# EAGLE schematic at32 (EAGLE 6.1)
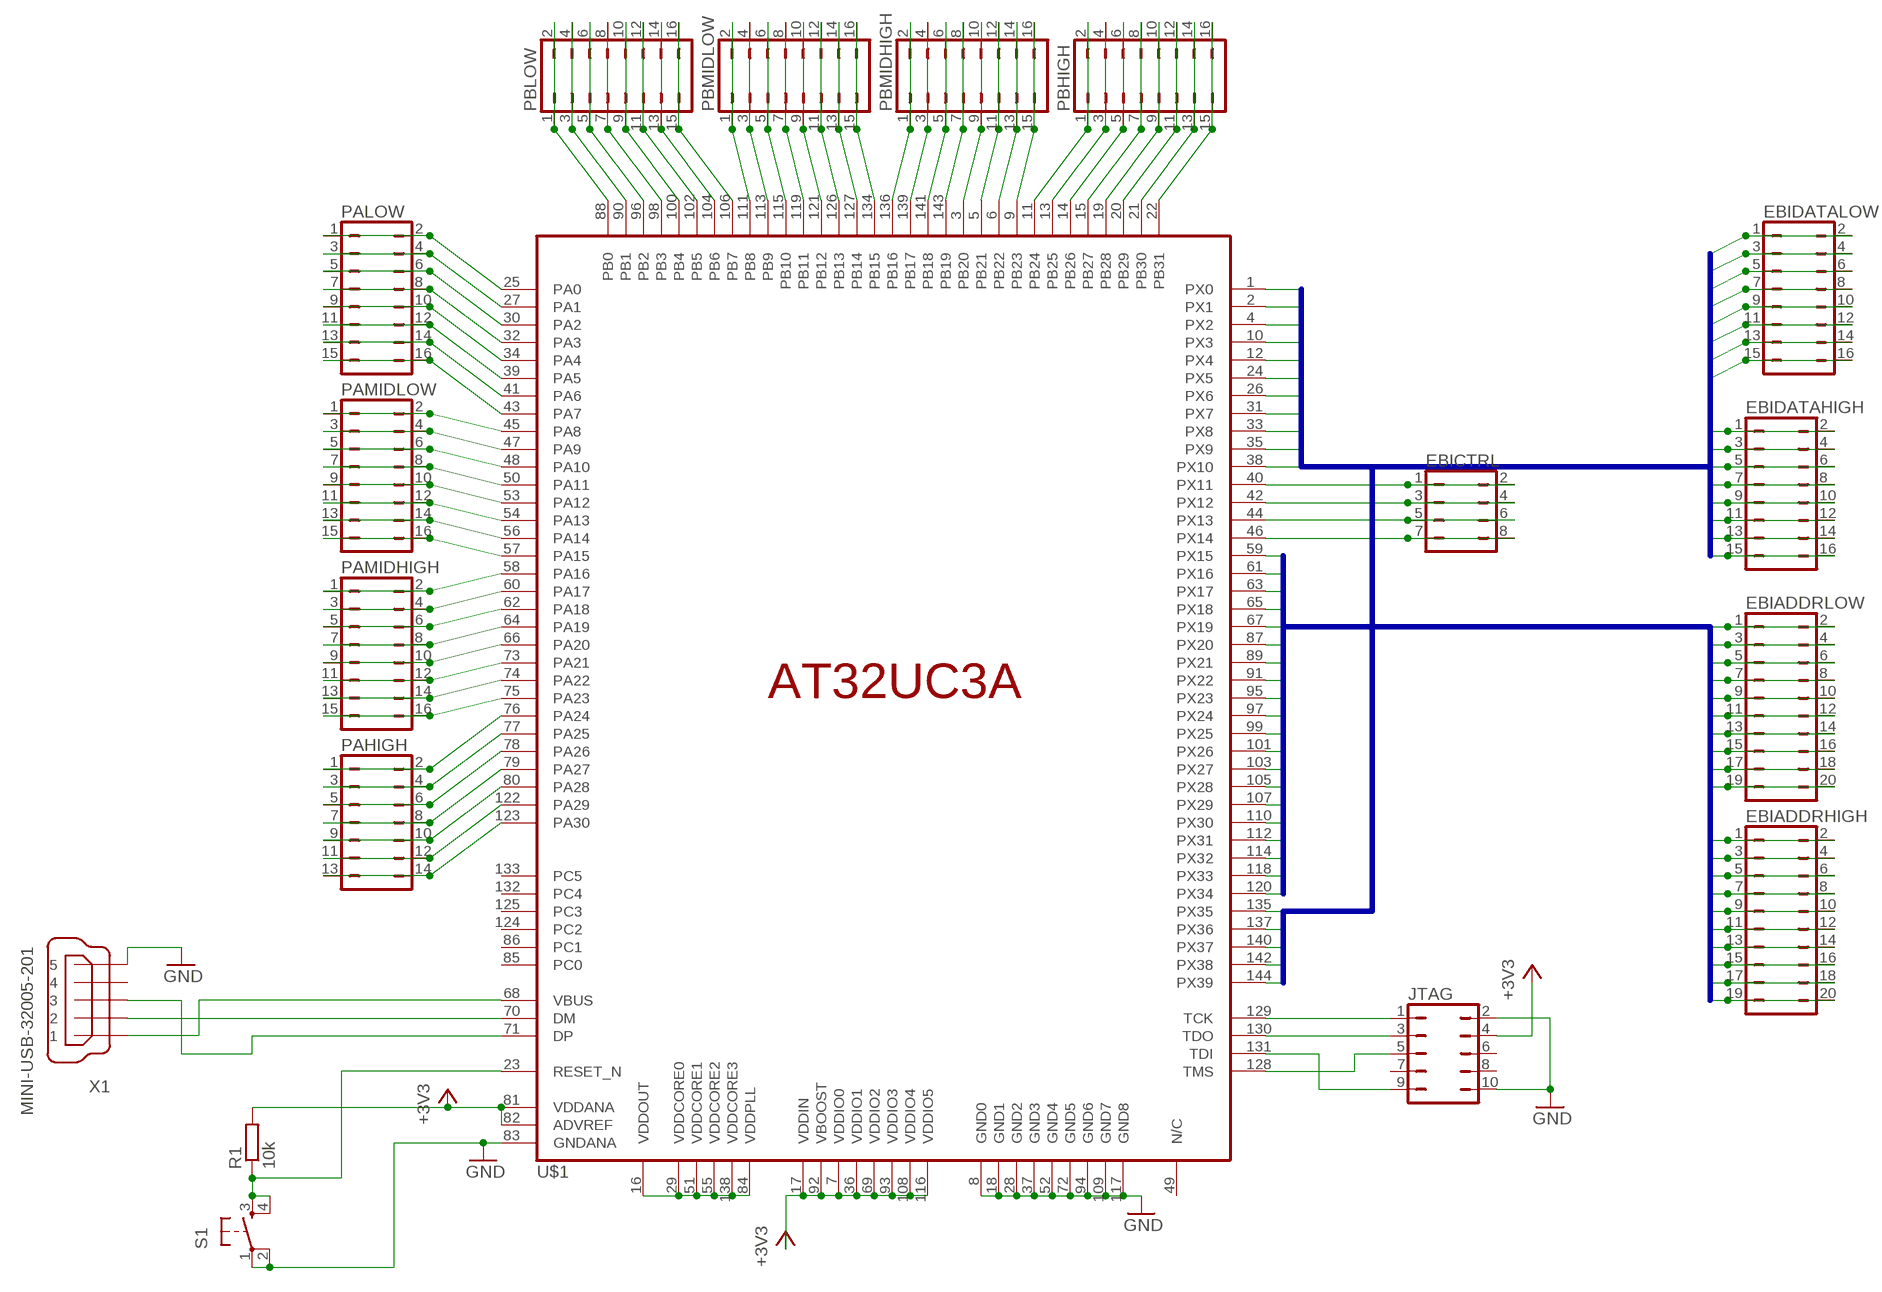
[diagram p0: schematic, sheet 1]

## Parts
EBIADDRHIGH  JP10Q  [JP10Q]
EBIADDRLOW  JP10Q  [JP10Q]
EBICTRL  JP4Q  [JP4Q]
EBIDATAHIGH  JP8Q  [JP8Q]
EBIDATALOW  JP8Q  [JP8Q]
JTAG  JP5Q  [JP5Q]
PAHIGH  JP7Q  [JP7Q]
PALOW  JP8Q  [JP8Q]
PAMIDHIGH  JP8Q  [JP8Q]
PAMIDLOW  JP8Q  [JP8Q]
PBHIGH  JP8Q  [JP8Q]
PBLOW  JP8Q  [JP8Q]
PBMIDHIGH  JP8Q  [JP8Q]
PBMIDLOW  JP8Q  [JP8Q]
R1  10k  R-EU_M2012  [M2012]
S1  TAC_SWITCHPTH  [TACTILE-PTH]
U$1  AVR32UC3AVQFP144  [VQFP144]
X1  MINI-USB-32005-201  [32005-201]

## Nets
+3V3: JTAG.4 R1.2 U$1.7(VDDIO0) U$1.17(VDDIN) U$1.36(VDDIO1) U$1.69(VDDIO2) U$1.81(VDDANA) U$1.82(ADVREF) U$1.92(VBOOST) U$1.93(VDDIO3) U$1.108(VDDIO4) U$1.116(VDDIO5)
EBIADDR0: EBIADDRLOW.1 EBIADDRLOW.2 U$1.120(PX34)
EBIADDR1: EBIADDRLOW.3 EBIADDRLOW.4 U$1.118(PX33)
EBIADDR2: EBIADDRLOW.5 EBIADDRLOW.6 U$1.114(PX32)
EBIADDR3: EBIADDRLOW.7 EBIADDRLOW.8 U$1.112(PX31)
EBIADDR4: EBIADDRLOW.9 EBIADDRLOW.10 U$1.110(PX30)
EBIADDR5: EBIADDRLOW.11 EBIADDRLOW.12 U$1.107(PX29)
EBIADDR6: EBIADDRLOW.13 EBIADDRLOW.14 U$1.105(PX28)
EBIADDR7: EBIADDRLOW.15 EBIADDRLOW.16 U$1.103(PX27)
EBIADDR8: EBIADDRLOW.17 EBIADDRLOW.18 U$1.101(PX26)
EBIADDR9: EBIADDRLOW.19 EBIADDRLOW.20 U$1.99(PX25)
EBIADDR10: EBIADDRHIGH.1 EBIADDRHIGH.2 U$1.97(PX24)
EBIADDR11: EBIADDRHIGH.3 EBIADDRHIGH.4 U$1.95(PX23)
EBIADDR12: EBIADDRHIGH.5 EBIADDRHIGH.6 U$1.91(PX22)
EBIADDR13: EBIADDRHIGH.7 EBIADDRHIGH.8 U$1.89(PX21)
EBIADDR14: EBIADDRHIGH.9 EBIADDRHIGH.10 U$1.87(PX20)
EBIADDR15: EBIADDRHIGH.11 EBIADDRHIGH.12 U$1.67(PX19)
EBIADDR16: EBIADDRHIGH.13 EBIADDRHIGH.14 U$1.65(PX18)
EBIADDR17: EBIADDRHIGH.15 EBIADDRHIGH.16 U$1.63(PX17)
EBIADDR18: EBIADDRHIGH.17 EBIADDRHIGH.18 U$1.61(PX16)
EBIADDR19: EBIADDRHIGH.19 EBIADDRHIGH.20 U$1.59(PX15)
EBIDATA0: EBIDATALOW.1 EBIDATALOW.2 U$1.38(PX10)
EBIDATA1: EBIDATALOW.3 EBIDATALOW.4 U$1.35(PX9)
EBIDATA2: EBIDATALOW.5 EBIDATALOW.6 U$1.33(PX8)
EBIDATA3: EBIDATALOW.7 EBIDATALOW.8 U$1.31(PX7)
EBIDATA4: EBIDATALOW.9 EBIDATALOW.10 U$1.26(PX6)
EBIDATA5: EBIDATALOW.11 EBIDATALOW.12 U$1.24(PX5)
EBIDATA6: EBIDATALOW.13 EBIDATALOW.14 U$1.12(PX4)
EBIDATA7: EBIDATALOW.15 EBIDATALOW.16 U$1.10(PX3)
EBIDATA8: EBIDATAHIGH.1 EBIDATAHIGH.2 U$1.4(PX2)
EBIDATA9: EBIDATAHIGH.3 EBIDATAHIGH.4 U$1.2(PX1)
EBIDATA10: EBIDATAHIGH.5 EBIDATAHIGH.6 U$1.1(PX0)
EBIDATA11: EBIDATAHIGH.7 EBIDATAHIGH.8 U$1.144(PX39)
EBIDATA12: EBIDATAHIGH.9 EBIDATAHIGH.10 U$1.142(PX38)
EBIDATA13: EBIDATAHIGH.11 EBIDATAHIGH.12 U$1.140(PX37)
EBIDATA14: EBIDATAHIGH.13 EBIDATAHIGH.14 U$1.137(PX36)
EBIDATA15: EBIDATAHIGH.15 EBIDATAHIGH.16 U$1.135(PX35)
GND: JTAG.2 JTAG.10 S1.1 S1.2 U$1.8(GND0) U$1.18(GND1) U$1.28(GND2) U$1.37(GND3) U$1.52(GND4) U$1.72(GND5) U$1.83(GNDANA) U$1.94(GND6) U$1.109(GND7) U$1.117(GND8) X1.5
N$1: U$1.70(DM) X1.2
N$2: U$1.68(VBUS) X1.1
N$3: U$1.71(DP) X1.3
N$4: EBICTRL.1 EBICTRL.2 U$1.40(PX11)
N$5: JTAG.1 U$1.129(TCK)
N$6: JTAG.3 U$1.130(TDO)
N$7: JTAG.5 U$1.128(TMS)
N$8: JTAG.9 U$1.131(TDI)
N$9: U$1.16(VDDOUT) U$1.29(VDDCORE0) U$1.51(VDDCORE1) U$1.55(VDDCORE2) U$1.84(VDDPLL) U$1.138(VDDCORE3)
N$10: EBICTRL.3 EBICTRL.4 U$1.42(PX12)
N$11: EBICTRL.5 EBICTRL.6 U$1.44(PX13)
N$12: EBICTRL.7 EBICTRL.8 U$1.46(PX14)
N$13: PBLOW.1 PBLOW.2 U$1.88(PB0)
N$14: PBLOW.3 PBLOW.4 U$1.90(PB1)
N$15: PBLOW.5 PBLOW.6 U$1.96(PB2)
N$16: PBLOW.7 PBLOW.8 U$1.98(PB3)
N$17: PBLOW.9 PBLOW.10 U$1.100(PB4)
N$18: PBLOW.11 PBLOW.12 U$1.102(PB5)
N$19: PBLOW.13 PBLOW.14 U$1.104(PB6)
N$20: PBLOW.15 PBLOW.16 U$1.106(PB7)
N$21: PBMIDLOW.1 PBMIDLOW.2 U$1.111(PB8)
N$22: PBMIDLOW.3 PBMIDLOW.4 U$1.113(PB9)
N$23: PBMIDLOW.5 PBMIDLOW.6 U$1.115(PB10)
N$24: PBMIDLOW.7 PBMIDLOW.8 U$1.119(PB11)
N$25: PBMIDLOW.9 PBMIDLOW.10 U$1.121(PB12)
N$26: PBMIDLOW.11 PBMIDLOW.12 U$1.126(PB13)
N$27: PBMIDLOW.13 PBMIDLOW.14 U$1.127(PB14)
N$28: PBMIDLOW.15 PBMIDLOW.16 U$1.134(PB15)
N$29: PBMIDHIGH.1 PBMIDHIGH.2 U$1.136(PB16)
N$30: PBMIDHIGH.3 PBMIDHIGH.4 U$1.139(PB17)
N$31: PBMIDHIGH.5 PBMIDHIGH.6 U$1.141(PB18)
N$32: PBMIDHIGH.7 PBMIDHIGH.8 U$1.143(PB19)
N$33: PBMIDHIGH.9 PBMIDHIGH.10 U$1.3(PB20)
N$34: PBMIDHIGH.11 PBMIDHIGH.12 U$1.5(PB21)
N$35: PBMIDHIGH.13 PBMIDHIGH.14 U$1.6(PB22)
N$36: PBMIDHIGH.15 PBMIDHIGH.16 U$1.9(PB23)
N$37: PBHIGH.1 PBHIGH.2 U$1.11(PB24)
N$38: PBHIGH.3 PBHIGH.4 U$1.13(PB25)
N$39: PBHIGH.5 PBHIGH.6 U$1.14(PB26)
N$40: PBHIGH.7 PBHIGH.8 U$1.15(PB27)
N$41: PBHIGH.9 PBHIGH.10 U$1.19(PB28)
N$42: PBHIGH.11 PBHIGH.12 U$1.20(PB29)
N$43: PBHIGH.13 PBHIGH.14 U$1.21(PB30)
N$44: PBHIGH.15 PBHIGH.16 U$1.22(PB31)
N$45: PAHIGH.13 PAHIGH.14 U$1.123(PA30)
N$46: PAHIGH.11 PAHIGH.12 U$1.122(PA29)
N$47: PAHIGH.9 PAHIGH.10 U$1.80(PA28)
N$48: PAHIGH.7 PAHIGH.8 U$1.79(PA27)
N$49: PAHIGH.5 PAHIGH.6 U$1.78(PA26)
N$50: PAHIGH.3 PAHIGH.4 U$1.77(PA25)
N$51: PAHIGH.1 PAHIGH.2 U$1.76(PA24)
N$52: PAMIDHIGH.15 PAMIDHIGH.16 U$1.75(PA23)
N$53: PAMIDHIGH.13 PAMIDHIGH.14 U$1.74(PA22)
N$54: PAMIDHIGH.11 PAMIDHIGH.12 U$1.73(PA21)
N$55: PAMIDHIGH.9 PAMIDHIGH.10 U$1.66(PA20)
N$56: PAMIDHIGH.7 PAMIDHIGH.8 U$1.64(PA19)
N$57: PAMIDHIGH.5 PAMIDHIGH.6 U$1.62(PA18)
N$58: PAMIDHIGH.3 PAMIDHIGH.4 U$1.60(PA17)
N$59: PAMIDHIGH.1 PAMIDHIGH.2 U$1.58(PA16)
N$60: PAMIDLOW.15 PAMIDLOW.16 U$1.57(PA15)
N$61: PAMIDLOW.13 PAMIDLOW.14 U$1.56(PA14)
N$62: PAMIDLOW.11 PAMIDLOW.12 U$1.54(PA13)
N$63: PAMIDLOW.9 PAMIDLOW.10 U$1.53(PA12)
N$64: PAMIDLOW.7 PAMIDLOW.8 U$1.50(PA11)
N$65: PAMIDLOW.5 PAMIDLOW.6 U$1.48(PA10)
N$66: PAMIDLOW.3 PAMIDLOW.4 U$1.47(PA9)
N$67: PAMIDLOW.1 PAMIDLOW.2 U$1.45(PA8)
N$68: PALOW.15 PALOW.16 U$1.43(PA7)
N$69: PALOW.13 PALOW.14 U$1.41(PA6)
N$70: PALOW.11 PALOW.12 U$1.39(PA5)
N$71: PALOW.9 PALOW.10 U$1.34(PA4)
N$72: PALOW.7 PALOW.8 U$1.32(PA3)
N$73: PALOW.5 PALOW.6 U$1.30(PA2)
N$74: PALOW.3 PALOW.4 U$1.27(PA1)
N$75: PALOW.1 PALOW.2 U$1.25(PA0)
N$76: R1.1 S1.3 S1.4 U$1.23(RESET_N)
Unconnected: JTAG.6 JTAG.7 JTAG.8 U$1.49(N/C) U$1.85(PC0) U$1.86(PC1) U$1.124(PC2) U$1.125(PC3) U$1.132(PC4) U$1.133(PC5) X1.4

## Buses
EBIDATA[0..15]
EBIADDR[0..19]

## Library data of the parts
EBIADDRHIGH EBIADDRLOW = jumper:JP10Q: JUMPER
EBICTRL = jumper:JP4Q: JUMPER
EBIDATAHIGH EBIDATALOW PALOW PAMIDHIGH PAMIDLOW PBHIGH PBLOW PBMIDHIGH PBMIDLOW = jumper:JP8Q: JUMPER
JTAG = jumper:JP5Q: JUMPER
PAHIGH = jumper:JP7Q: JUMPER
R1 = resistor:R-EU_: RESISTOR, European symbol
S1 = SparkFun:TAC_SWITCH: Momentary Switch Button commonly used for reset or general input. Spark Fun Electronics SKU : COM-00097
U$1 = avr32uca:AVR32UC3A
X1 = con-cypressindustries:MINI-USB-: MINI USB-B Conector Source: www.cypressindustries.com; OC_FARNELL: unknown; OC_NEWARK: unknown